# Altium schematic sheet 780-00029, Backplane, SuperFin Configuration.SchDoc
size B; PageSetup: Record=PageOptions|CenterHorizontal=True|CenterVertical=True|PrintScale=1.09|XCorrection=1.00|YCorrection=1.00|PrintKind=0|BorderSize=5000000|LeftOffset=0|BottomOffset=0|Orientation=2|PaperLength=1000|PaperWidth=1000|Scale=100|PaperSource=7|PrintQuality=-4|MediaType=1|DitherType=10|PaperKind=Tabloid 11 x 17in|PrintScaleMode=1
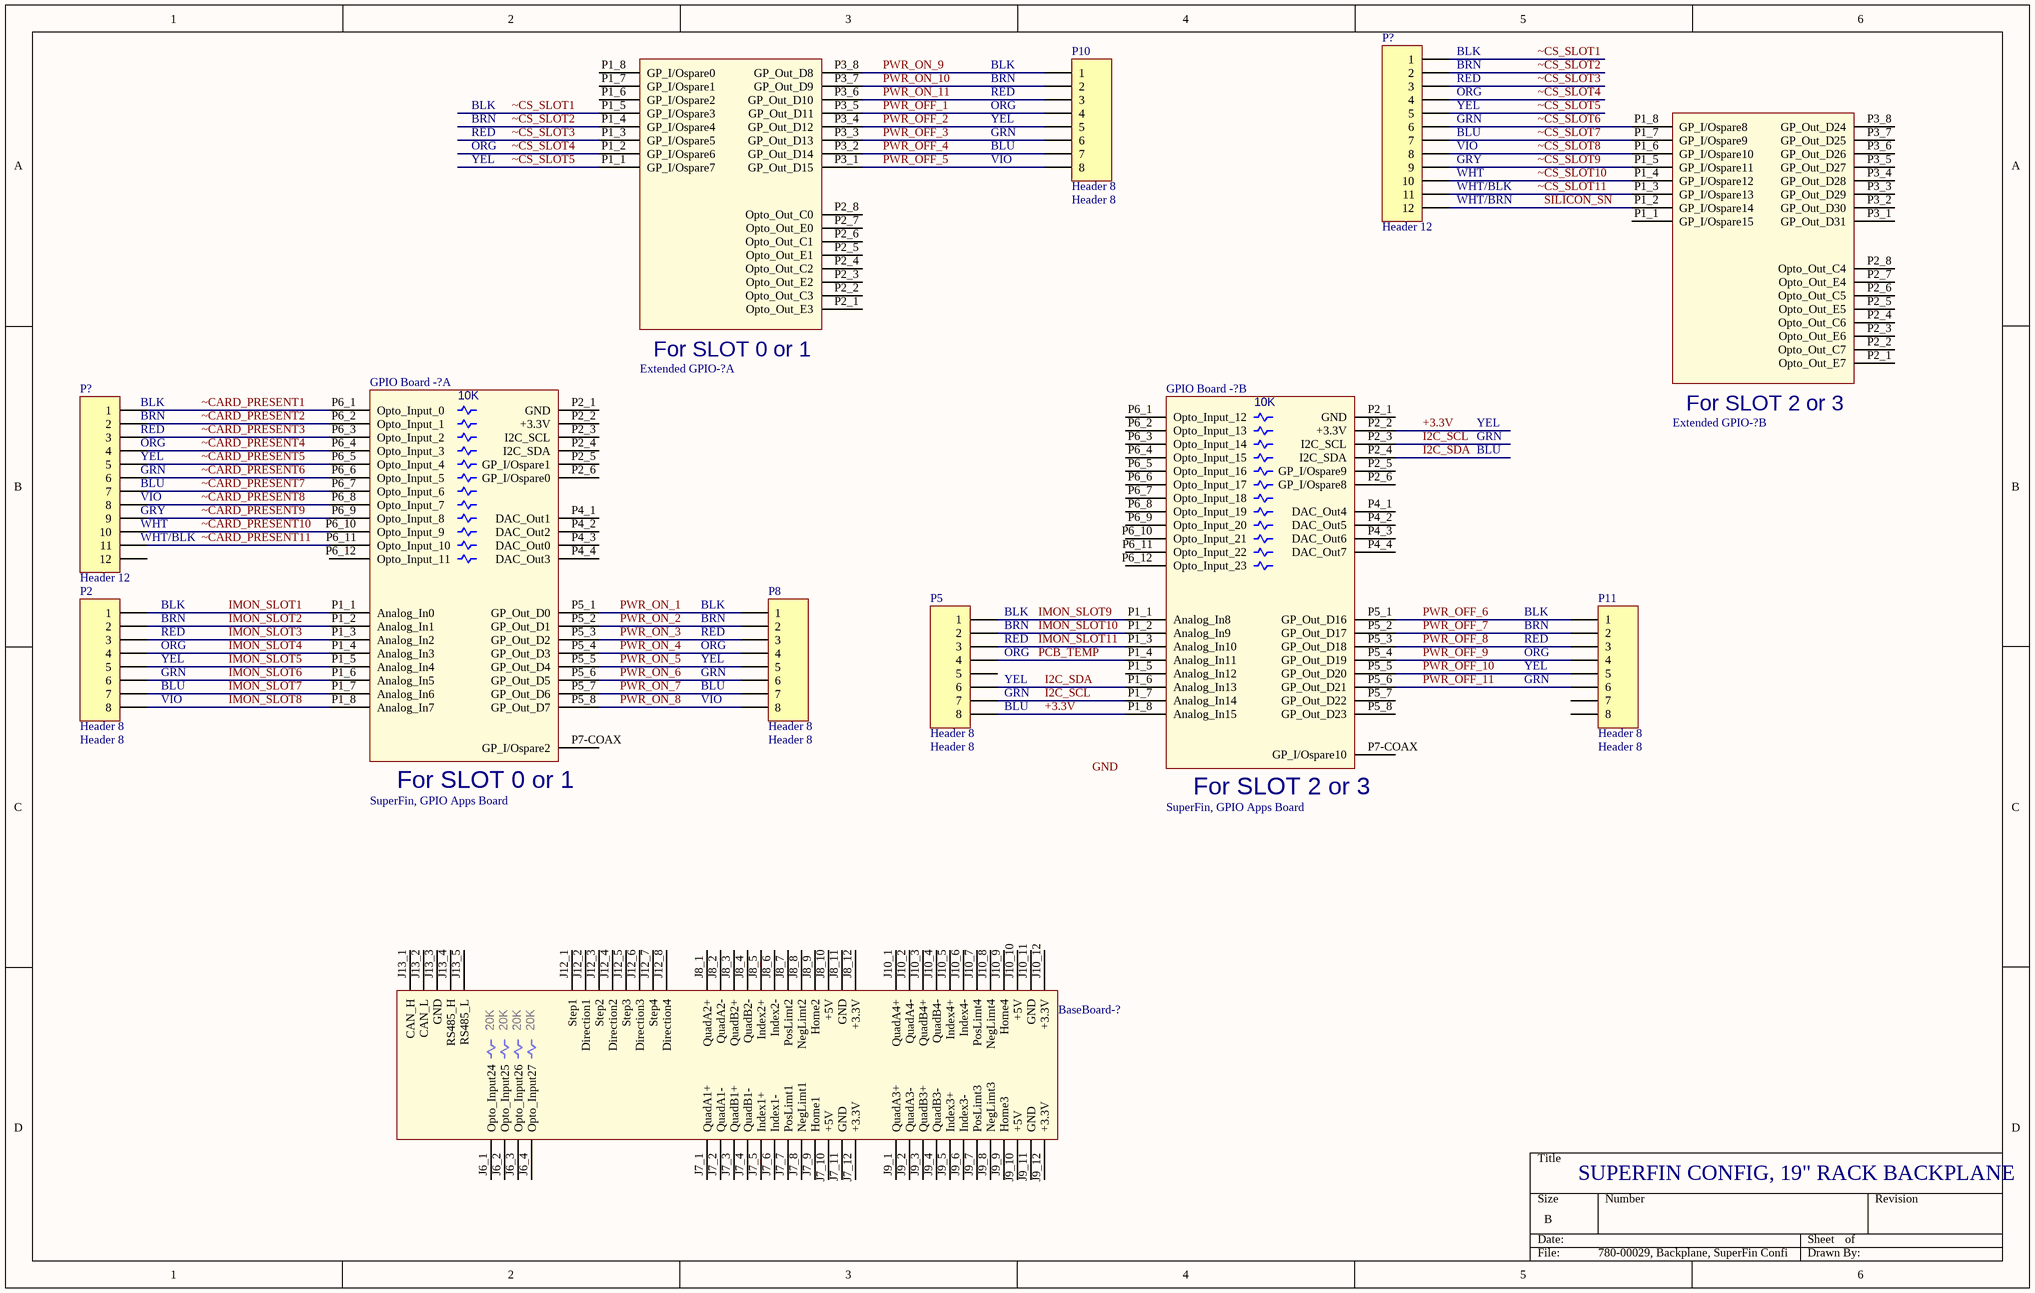
[diagram p0: 780-00029, Backplane, SuperFin Configuration.SchDoc]

## Parts
(Parts that share a designator on the sheet are numbered #1, #2 ... from top to bottom, then left to right.)
BaseBoard-?  SuperFin BaseBoard  (value not drawn)
Extended_GPIO-?#1  SuperFin, Extended GPIO Apps Board  (value not drawn)  (part A of 2)
Extended_GPIO-?#2  SuperFin, Extended GPIO Apps Board  (value not drawn)  (part B of 2)
GPIO_Board_-?#1  SuperFin, GPIO Apps Board  (part A of 2)
GPIO_Board_-?#2  SuperFin, GPIO Apps Board  (part B of 2)
P2  Header 8  [HDR1X8 for IDC]
P5  Header 8  [HDR1X8 for IDC]
P8  Header 8  [HDR1X8 for IDC]
P10  Header 8  [HDR1X8 for IDC]
P11  Header 8  [HDR1X8 for IDC]
P?#1  Header 12  [HDR1X12 for IDC]
P?#2  Header 12  [HDR1X12 for IDC]

## Nets
+3.3V: GPIO_Board_-?#2.P1_8(Analog_In15) GPIO_Board_-?#2.P2_2(+3.3V) P5.8
I2C_SCL: GPIO_Board_-?#2.P1_7(Analog_In14) GPIO_Board_-?#2.P2_3(I2C_SCL) P5.7
I2C_SDA: GPIO_Board_-?#2.P1_6(Analog_In13) GPIO_Board_-?#2.P2_4(I2C_SDA) P5.6
IMON_SLOT1: GPIO_Board_-?#1.P1_1(Analog_In0) P2.1
IMON_SLOT2: GPIO_Board_-?#1.P1_2(Analog_In1) P2.2
IMON_SLOT3: GPIO_Board_-?#1.P1_3(Analog_In2) P2.3
IMON_SLOT4: GPIO_Board_-?#1.P1_4(Analog_In3) P2.4
IMON_SLOT5: GPIO_Board_-?#1.P1_5(Analog_In4) P2.5
IMON_SLOT6: GPIO_Board_-?#1.P1_6(Analog_In5) P2.6
IMON_SLOT7: GPIO_Board_-?#1.P1_7(Analog_In6) P2.7
IMON_SLOT8: GPIO_Board_-?#1.P1_8(Analog_In7) P2.8
IMON_SLOT9: GPIO_Board_-?#2.P1_1(Analog_In8) P5.1
IMON_SLOT10: GPIO_Board_-?#2.P1_2(Analog_In9) P5.2
IMON_SLOT11: GPIO_Board_-?#2.P1_3(Analog_In10) P5.3
PCB_TEMP: GPIO_Board_-?#2.P1_4(Analog_In11) P5.4
PWR_OFF_1: Extended_GPIO-?#1.P3_5(GP_Out_D11) P10.4
PWR_OFF_2: Extended_GPIO-?#1.P3_4(GP_Out_D12) P10.5
PWR_OFF_3: Extended_GPIO-?#1.P3_3(GP_Out_D13) P10.6
PWR_OFF_4: Extended_GPIO-?#1.P3_2(GP_Out_D14) P10.7
PWR_OFF_5: Extended_GPIO-?#1.P3_1(GP_Out_D15) P10.8
PWR_OFF_6: GPIO_Board_-?#2.P5_1(GP_Out_D16) P11.1
PWR_OFF_7: GPIO_Board_-?#2.P5_2(GP_Out_D17) P11.2
PWR_OFF_8: GPIO_Board_-?#2.P5_3(GP_Out_D18) P11.3
PWR_OFF_9: GPIO_Board_-?#2.P5_4(GP_Out_D19) P11.4
PWR_OFF_10: GPIO_Board_-?#2.P5_5(GP_Out_D20) P11.5
PWR_OFF_11: GPIO_Board_-?#2.P5_6(GP_Out_D21) P11.6
PWR_ON_1: GPIO_Board_-?#1.P5_1(GP_Out_D0) P8.1
PWR_ON_2: GPIO_Board_-?#1.P5_2(GP_Out_D1) P8.2
PWR_ON_3: GPIO_Board_-?#1.P5_3(GP_Out_D2) P8.3
PWR_ON_4: GPIO_Board_-?#1.P5_4(GP_Out_D3) P8.4
PWR_ON_5: GPIO_Board_-?#1.P5_5(GP_Out_D4) P8.5
PWR_ON_6: GPIO_Board_-?#1.P5_6(GP_Out_D5) P8.6
PWR_ON_7: GPIO_Board_-?#1.P5_7(GP_Out_D6) P8.7
PWR_ON_8: GPIO_Board_-?#1.P5_8(GP_Out_D7) P8.8
PWR_ON_9: Extended_GPIO-?#1.P3_8(GP_Out_D8) P10.1
PWR_ON_10: Extended_GPIO-?#1.P3_7(GP_Out_D9) P10.2
PWR_ON_11: Extended_GPIO-?#1.P3_6(GP_Out_D10) P10.3
SILICON_SN: Extended_GPIO-?#2.P1_2(GP_I/Ospare14) P?#1.12
~CARD_PRESENT1: GPIO_Board_-?#1.P6_1(Opto_Input_0) P?#2.1
~CARD_PRESENT2: GPIO_Board_-?#1.P6_2(Opto_Input_1) P?#2.2
~CARD_PRESENT3: GPIO_Board_-?#1.P6_3(Opto_Input_2) P?#2.3
~CARD_PRESENT4: GPIO_Board_-?#1.P6_4(Opto_Input_3) P?#2.4
~CARD_PRESENT5: GPIO_Board_-?#1.P6_5(Opto_Input_4) P?#2.5
~CARD_PRESENT6: GPIO_Board_-?#1.P6_6(Opto_Input_5) P?#2.6
~CARD_PRESENT7: GPIO_Board_-?#1.P6_7(Opto_Input_6) P?#2.7
~CARD_PRESENT8: GPIO_Board_-?#1.P6_8(Opto_Input_7) P?#2.8
~CARD_PRESENT9: GPIO_Board_-?#1.P6_9(Opto_Input_8) P?#2.9
~CARD_PRESENT10: GPIO_Board_-?#1.P6_10(Opto_Input_9) P?#2.10
~CARD_PRESENT11: GPIO_Board_-?#1.P6_11(Opto_Input_10) P?#2.11
~CS_SLOT1: Extended_GPIO-?#1.P1_5(GP_I/Ospare3) P?#1.1
~CS_SLOT2: Extended_GPIO-?#1.P1_4(GP_I/Ospare4) P?#1.2
~CS_SLOT3: Extended_GPIO-?#1.P1_3(GP_I/Ospare5) P?#1.3
~CS_SLOT4: Extended_GPIO-?#1.P1_2(GP_I/Ospare6) P?#1.4
~CS_SLOT5: Extended_GPIO-?#1.P1_1(GP_I/Ospare7) P?#1.5
~CS_SLOT6: Extended_GPIO-?#2.P1_8(GP_I/Ospare8) P?#1.6
~CS_SLOT7: Extended_GPIO-?#2.P1_7(GP_I/Ospare9) P?#1.7
~CS_SLOT8: Extended_GPIO-?#2.P1_6(GP_I/Ospare10) P?#1.8
~CS_SLOT9: Extended_GPIO-?#2.P1_5(GP_I/Ospare11) P?#1.9
~CS_SLOT10: Extended_GPIO-?#2.P1_4(GP_I/Ospare12) P?#1.10
~CS_SLOT11: Extended_GPIO-?#2.P1_3(GP_I/Ospare13) P?#1.11

Not connected (* = marked no-connect by the designer): BaseBoard-? J6_1(Opto_Input24) J6_2(Opto_Input25) J6_3(Opto_Input26) J6_4(Opto_Input27) J7_1(QuadA1+) J7_2(QuadA1-) J7_3(QuadB1+) J7_4(QuadB1-) J7_5(Index1+) J7_6(Index1-) J7_7(PosLimt1) J7_8(NegLimt1) J7_9(Home1) J7_10(+5V) J7_11(GND) J7_12(+3.3V) J8_1(QuadA2+) J8_2(QuadA2-) J8_3(QuadB2+) J8_4(QuadB2-) J8_5(Index2+) J8_6(Index2-) J8_7(PosLimt2) J8_8(NegLimt2) J8_9(Home2) J8_10(+5V) J8_11(GND) J8_12(+3.3V) J9_1(QuadA3+) J9_2(QuadA3-) J9_3(QuadB3+) J9_4(QuadB3-) J9_5(Index3+) J9_6(Index3-) J9_7(PosLimt3) J9_8(NegLimt3) J9_9(Home3) J9_10(+5V) J9_11(GND) J9_12(+3.3V) J10_1(QuadA4+) J10_2(QuadA4-) J10_3(QuadB4+) J10_4(QuadB4-) J10_5(Index4+) J10_6(Index4-) J10_7(PosLimt4) J10_8(NegLimt4) J10_9(Home4) J10_10(+5V) J10_11(GND) J10_12(+3.3V) J12_1(Step1) J12_2(Direction1) J12_3(Step2) J12_4(Direction2) J12_5(Step3) J12_6(Direction3) J12_7(Step4) J12_8(Direction4) J13_1(CAN_H) J13_2(CAN_L) J13_3(GND) J13_4(RS485_H) J13_5(RS485_L); Extended_GPIO-?#1 P1_6(GP_I/Ospare2) P1_7(GP_I/Ospare1) P1_8(GP_I/Ospare0) P2_1(Opto_Out_E3) P2_2(Opto_Out_C3) P2_3(Opto_Out_E2) P2_4(Opto_Out_C2) P2_5(Opto_Out_E1) P2_6(Opto_Out_C1) P2_7(Opto_Out_E0) P2_8(Opto_Out_C0); Extended_GPIO-?#2 P1_1(GP_I/Ospare15) P2_1(Opto_Out_E7) P2_2(Opto_Out_C7) P2_3(Opto_Out_E6) P2_4(Opto_Out_C6) P2_5(Opto_Out_E5) P2_6(Opto_Out_C5) P2_7(Opto_Out_E4) P2_8(Opto_Out_C4) P3_1(GP_Out_D31) P3_2(GP_Out_D30) P3_3(GP_Out_D29) P3_4(GP_Out_D28) P3_5(GP_Out_D27) P3_6(GP_Out_D26) P3_7(GP_Out_D25) P3_8(GP_Out_D24); GPIO_Board_-?#1 P2_1(GND) P2_2(+3.3V) P2_3(I2C_SCL) P2_4(I2C_SDA) P2_5(GP_I/Ospare1) P2_6(GP_I/Ospare0) P4_1(DAC_Out1) P4_2(DAC_Out2) P4_3(DAC_Out0) P4_4(DAC_Out3) P6_12(Opto_Input_11) P7-COAX(GP_I/Ospare2); GPIO_Board_-?#2 P1_5(Analog_In12) P2_1(GND) P2_5(GP_I/Ospare9) P2_6(GP_I/Ospare8) P4_1(DAC_Out4) P4_2(DAC_Out5) P4_3(DAC_Out6) P4_4(DAC_Out7) P5_7(GP_Out_D22) P5_8(GP_Out_D23) P6_1(Opto_Input_12) P6_2(Opto_Input_13) P6_3(Opto_Input_14) P6_4(Opto_Input_15) P6_5(Opto_Input_16) P6_6(Opto_Input_17) P6_7(Opto_Input_18) P6_8(Opto_Input_19) P6_9(Opto_Input_20) P6_10(Opto_Input_21) P6_11(Opto_Input_22) P6_12(Opto_Input_23) P7-COAX(GP_I/Ospare10); P5 5; P11 7 8; P?#2 12

## Notes on the sheet
- BLK
- BRN
- RED
- (near P?#1) BLK
- (near P?#1) BRN
- (near P?#1) RED
- (near P?#1) ORG
- ORG
- YEL
- GRN
- BLU
- VIO
- (near P?#1) YEL
- (near P?#1) GRN
- (near P?#1) BLU
- (near P?#1) VIO
- (near P?#1) GRY
- (near P?#1) WHT
- (near P?#1) WHT/BLK
- (near P?#1) WHT/BRN
- (near P?#2) BLK
- (near P?#2) BRN
- (near P?#2) RED
- (near P?#2) ORG
- (near P?#2) YEL
- (near P?#2) GRN
- (near P?#2) BLU
- (near P?#2) VIO
- (near P?#2) GRY
- (near P?#2) WHT
- (near P?#2) WHT/BLK
- (near P2) BRN
- (near P2) RED
- (near P8) BLK
- (near P8) BRN
- (near P8) RED
- (near P5) BLK
- (near P5) BRN
- (near P5) RED
- (near P2) ORG
- (near P2) YEL
- (near P2) GRN
- (near P2) BLU
- (near P2) VIO
- (near P8) ORG
- (near P8) YEL
- (near P8) GRN
- (near P8) BLU
- (near P8) VIO
- (near P5) ORG
- (near P5) YEL
- (near P5) GRN
- (near P5) BLU
- SUPERFIN CONFIG, 19" RACK BACKPLANE
- Labels drawn without touching a wire or pin: GND
- (in symbol SuperFin BaseBoard) 20K
- (in symbol SuperFin, Extended GPIO Apps Board, part A) For SLOT 0 or 1
- (in symbol SuperFin, Extended GPIO Apps Board, part B) For SLOT 2 or 3
- (in symbol SuperFin, GPIO Apps Board, part A) 10K; For SLOT 0 or 1
- (in symbol SuperFin, GPIO Apps Board, part B) 10K; For SLOT 2 or 3

## Library data of the parts
P2 P5 P8 P10 P11 = Header 8: Header, 8-Pin; LCO p/n: 125-00047; VALUE: Header 8
P?#1 P?#2 = Header 12: Header, 12-Pin; Manufacturer: Tyco; Manuf p/n: 1-640456-2; Vendor: Digi-Key; Vendor p/n: A19475-ND; LCO p/n: XXXXXX; COST: 0.57; VALUE: Header 12